# EasyEDA schematic schematics.json
TITLE: Sheet_1; REV: 1.0; Date: 2020-02-26; Sheet: 1/1; Drawn By: Rufus31415; Company: Your Company
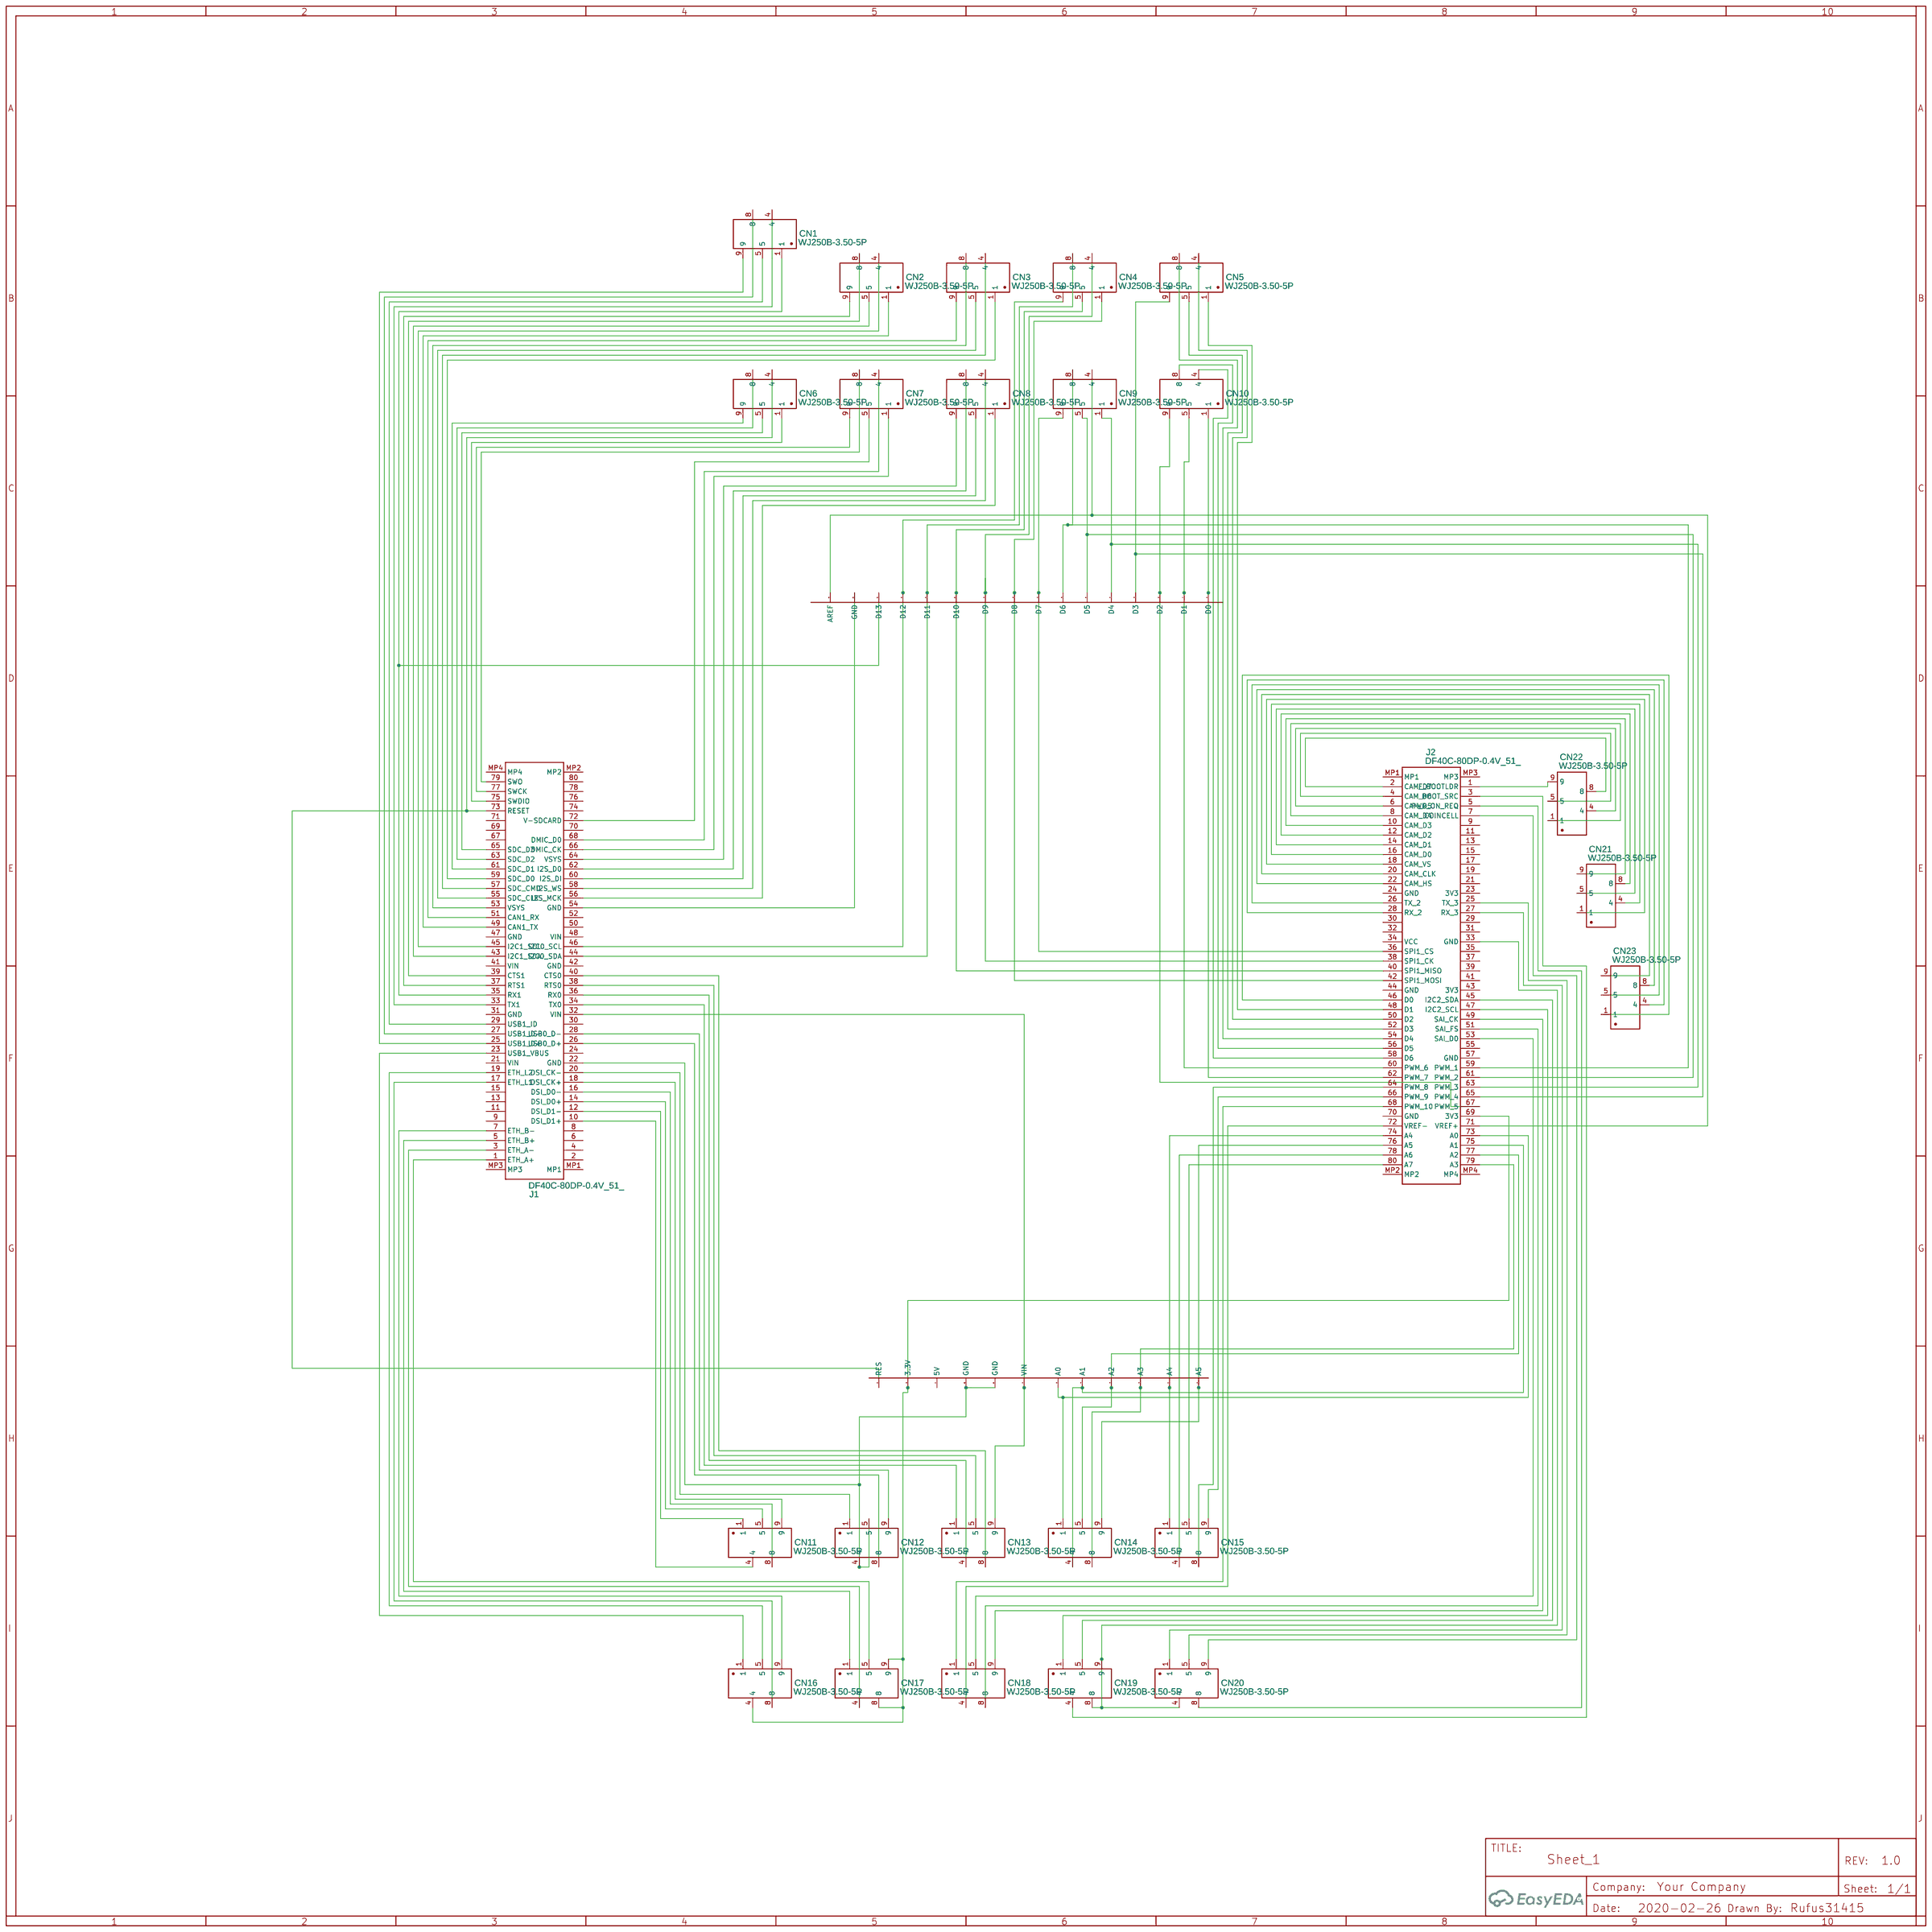
[diagram p0: schematic sheet]

## Parts
CN1  WJ250B-3.50-5P  [WJ250B-3.50-5P]
CN2  WJ250B-3.50-5P  [WJ250B-3.50-5P]
CN3  WJ250B-3.50-5P  [WJ250B-3.50-5P]
CN4  WJ250B-3.50-5P  [WJ250B-3.50-5P]
CN5  WJ250B-3.50-5P  [WJ250B-3.50-5P]
CN6  WJ250B-3.50-5P  [WJ250B-3.50-5P]
CN7  WJ250B-3.50-5P  [WJ250B-3.50-5P]
CN8  WJ250B-3.50-5P  [WJ250B-3.50-5P]
CN9  WJ250B-3.50-5P  [WJ250B-3.50-5P]
CN10  WJ250B-3.50-5P  [WJ250B-3.50-5P]
CN11  WJ250B-3.50-5P  [WJ250B-3.50-5P]
CN12  WJ250B-3.50-5P  [WJ250B-3.50-5P]
CN13  WJ250B-3.50-5P  [WJ250B-3.50-5P]
CN14  WJ250B-3.50-5P  [WJ250B-3.50-5P]
CN15  WJ250B-3.50-5P  [WJ250B-3.50-5P]
CN16  WJ250B-3.50-5P  [WJ250B-3.50-5P]
CN17  WJ250B-3.50-5P  [WJ250B-3.50-5P]
CN18  WJ250B-3.50-5P  [WJ250B-3.50-5P]
CN19  WJ250B-3.50-5P  [WJ250B-3.50-5P]
CN20  WJ250B-3.50-5P  [WJ250B-3.50-5P]
CN21  WJ250B-3.50-5P  [WJ250B-3.50-5P]
CN22  WJ250B-3.50-5P  [WJ250B-3.50-5P]
CN23  WJ250B-3.50-5P  [WJ250B-3.50-5P]
J1  DF40C-80DP-0.4V_51_  [DF40C80DP04V51]
J2  DF40C-80DP-0.4V_51_  [DF40C80DP04V51]
U1  ARDUINO_SHIELDNO_SILK BIG  [DUEMILANOVE_VIAS]

## Library data of the parts
CN1-CN23 = WJ250B-3.50-5P: Supplier: LCSC; Manufacturer: ReliaPro; image: //image.lceda.cn/szlcsc/C8453.jpg; Supplier Part: C8453
J1 J2 = DF40C-80DP-0.4V_51_
U1 = ARDUINO_SHIELDNO_SILK BIG: Arduino shield footprint; Contributor: SparkFun

## Nets
Net-(CN1-1): CN1.1 J1.35(RX1) U1.D13
Net-(CN1-4): CN1.4 J1.33(TX1)
Net-(CN1-5): CN1.5 J1.29(USB1 ID)
Net-(CN1-8): CN1.8 J1.27(USB1 D-)
Net-(CN1-9): CN1.9 J1.25(USB1 D+)
Net-(CN2-1): CN2.1 J1.49(CAN1 TX)
Net-(CN2-4): CN2.4 J1.45(I2C1 SCL)
Net-(CN2-5): CN2.5 J1.43(I2C1 SDA)
Net-(CN2-8): CN2.8 J1.39(CTS1)
Net-(CN2-9): CN2.9 J1.37(RTS1)
Net-(CN3-1): CN3.1 J1.59(SDC D0)
Net-(CN3-4): CN3.4 J1.57(SDC CMD)
Net-(CN3-5): CN3.5 J1.55(SDC CLK)
Net-(CN3-8): CN3.8 J1.53(VSYS)
Net-(CN3-9): CN3.9 J1.51(CAN1 RX)
Net-(CN4-1): CN4.1 J2.42(SPI1 MOSI) U1.D8
Net-(CN4-4): CN4.4 J2.38(SPI1 CK) U1.D9
Net-(CN4-5): CN4.5 J2.40(SPI1 MISO) U1.D10
Net-(CN4-8): CN4.8 J1.44(I2C0 SDA) U1.D11
Net-(CN4-9): CN4.9 J1.46(I2C0 SCL) U1.D12
Net-(CN5-1): CN5.1 J2.48(D1)
Net-(CN5-4): CN5.4 J2.50(D2)
Net-(CN5-5): CN5.5 J2.52(D3)
Net-(CN5-8): CN5.8 J2.54(D4)
Net-(CN5-9): CN5.9 J2.65(PWM 4) U1.D3
Net-(CN6-1): CN6.1 J1.75(SWDIO)
Net-(CN6-4): CN6.4 J1.73(RESET) U1.RES
Net-(CN6-5): CN6.5 J1.65(SDC D3)
Net-(CN6-8): CN6.8 J1.63(SDC D2)
Net-(CN6-9): CN6.9 J1.61(SDC D1)
Net-(CN7-1): CN7.1 J1.66(DMIC CK)
Net-(CN7-4): CN7.4 J1.68(DMIC D0)
Net-(CN7-5): CN7.5 J1.72(V-SDCARD)
Net-(CN7-8): CN7.8 J1.79(SWO)
Net-(CN7-9): CN7.9 J1.77(SWCK)
Net-(CN8-1): CN8.1 J1.56(I2S MCK)
Net-(CN8-4): CN8.4 J1.58(I2S WS)
Net-(CN8-5): CN8.5 J1.60(I2S DI)
Net-(CN8-8): CN8.8 J1.62(I2S D0)
Net-(CN8-9): CN8.9 J1.64(VSYS)
Net-(CN9-1): CN9.1 J2.63(PWM 3) U1.D4
Net-(CN9-4): CN9.4 J2.71(VREF+) U1.AREF
Net-(CN9-5): CN9.5 J2.61(PWM 2) U1.D5
Net-(CN9-8): CN9.8 J2.59(PWM 1) U1.D6
Net-(CN9-9): CN9.9 J2.36(SPI1 CS) U1.D7
Net-(CN10-1): CN10.1 J2.62(PWM 7) U1.RX(D0)
Net-(CN10-4): CN10.4 J2.58(D6)
Net-(CN10-5): CN10.5 J2.60(PWM 6) U1.TX(D1)
Net-(CN10-8): CN10.8 J2.56(D5)
Net-(CN10-9): CN10.9 J2.67(PWM 5) U1.D2
Net-(CN11-1): CN11.1 J1.12(DSI D1-)
Net-(CN11-4): CN11.4 J1.10(DSI D1+)
Net-(CN11-5): CN11.5 J1.14(DSI D0+)
Net-(CN11-8): CN11.8 J1.16(DSI D0-)
Net-(CN11-9): CN11.9 J1.18(DSI CK+)
Net-(CN12-1): CN12.1 J1.20(DSI CK-)
Net-(CN12-4): CN12.4 CN12.5 J1.22(GND) U1.GND@0(GND) U1.GND@1(GND)
Net-(CN12-8): CN12.8 J1.26(USB0 D+)
Net-(CN12-9): CN12.9 J1.28(USB0 D-)
Net-(CN13-1): CN13.1 J1.34(TX0)
Net-(CN13-4): CN13.4 J1.36(RX0)
Net-(CN13-5): CN13.5 J1.38(RTS0)
Net-(CN13-8): CN13.8 J1.40(CTS0)
Net-(CN13-9): CN13.9 J1.32(VIN) U1.VIN
Net-(CN14-1): CN14.1 J2.73(A0) U1.A0
Net-(CN14-4): CN14.4 J2.75(A1) U1.A1
Net-(CN14-5): CN14.5 J2.77(A2) U1.A2
Net-(CN14-8): CN14.8 J2.79(A3) U1.A3
Net-(CN14-9): CN14.9 CN15.1 J2.74(A4) J2.76(A5) U1.A4 U1.A5
Net-(CN15-4): CN15.4 J2.78(A6)
Net-(CN15-5): CN15.5 J2.80(A7)
Net-(CN15-8): CN15.8 J2.64(PWM 8)
Net-(CN15-9): CN15.9 J2.66(PWM 9)
Net-(CN16-1): CN16.1 J1.23(USB1 VBUS)
Net-(CN16-4): CN16.4 CN17.8 CN17.9 J2.69(3V3) U1.3.3V
Net-(CN16-5): CN16.5 J1.19(ETH L2)
Net-(CN16-8): CN16.8 J1.17(ETH L1)
Net-(CN16-9): CN16.9 J1.7(ETH B-)
Net-(CN17-1): CN17.1 J1.5(ETH B+)
Net-(CN17-4): CN17.4 J1.3(ETH A-)
Net-(CN17-5): CN17.5 J1.1(ETH A+)
Net-(CN18-1): CN18.1 J2.68(PWM 10)
Net-(CN18-4): CN18.4 J2.72(VREF-)
Net-(CN18-5): CN18.5 J2.53(SAI D0)
Net-(CN18-8): CN18.8 J2.51(SAI FS)
Net-(CN18-9): CN18.9 J2.49(SAI CK)
Net-(CN19-1): CN19.1 J2.47(I2C2 SCL)
Net-(CN19-4): CN19.4 J2.3(BOOT_SRC)
Net-(CN19-5): CN19.5 J2.45(I2C2 SDA)
Net-(CN19-8): CN19.8 CN19.9 CN20.4 J2.33(GND)
Net-(CN20-1): CN20.1 J2.27(RX 3)
Net-(CN20-5): CN20.5 J2.25(TX 3)
Net-(CN20-8): CN20.8 J2.5(PWR_ON_REQ)
Net-(CN20-9): CN20.9 J2.7(COINCELL)
Net-(CN21-1): CN21.1 J2.18(CAM VS)
Net-(CN21-4): CN21.4 J2.16(CAM D0)
Net-(CN21-5): CN21.5 J2.14(CAM D1)
Net-(CN21-8): CN21.8 J2.12(CAM D2)
Net-(CN21-9): CN21.9 J2.10(CAM D3)
Net-(CN22-1): CN22.1 J2.8(CAM D4)
Net-(CN22-4): CN22.4 J2.6(CAM D5)
Net-(CN22-5): CN22.5 J2.4(CAM D6)
Net-(CN22-8): CN22.8 J2.2(CAM D7)
Net-(CN22-9): CN22.9 J2.1(F_BOOTLDR)
Net-(CN23-1): CN23.1 J2.46(D0)
Net-(CN23-4): CN23.4 J2.28(RX 2)
Net-(CN23-5): CN23.5 J2.26(TX 2)
Net-(CN23-8): CN23.8 J2.22(CAM HS)
Net-(CN23-9): CN23.9 J2.20(CAM CLK)
Net-(J1-54): J1.54(GND) U1.GND@2(GND)

Not connected (* = marked no-connect by the designer): J1 2 4 6 8 9 11 13 15 21(VIN) 24 30 31(GND) 41(VIN) 42(GND) 47(GND) 48(VIN) 50 52 67 69 70 71 74 76 78 80 MP1 MP2 MP3 MP4; J2 9 11 13 15 17 19 21 23(3V3) 24(GND) 29 30 31 32 34(VCC) 35 37 39 41 43(3V3) 44(GND) 55 57(GND) 70(GND) MP1 MP2 MP3 MP4; U1 5V

## Notes on the sheet
- 109 pins utiles
